# Altium schematic sheet schSPI.SchDoc
size A4
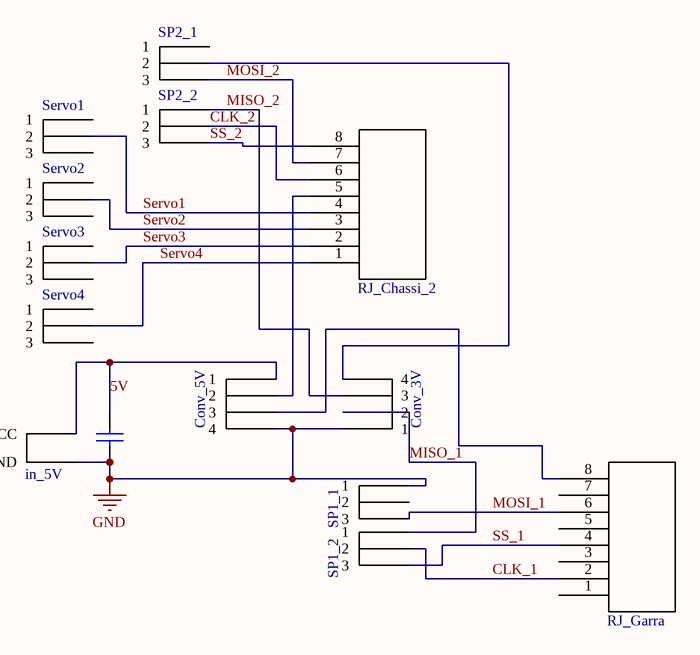
[diagram p0: schSPI.SchDoc]

## Parts
C2  Cap  [RAD-0.3]  (value not drawn)
Conv_3V  KK4  [4-vias]  (value not drawn)
Conv_5V  KK4  [4-vias]  (value not drawn)
in_5V  Jack  [JACK J4]  (value not drawn)
RJ_Chassi_2  RJ45  [RJ45_90]  (value not drawn)
RJ_Garra  RJ45  [RJ45_Simples]  (value not drawn)
Servo1  KK3  [3-vias]  (value not drawn)
Servo2  KK3  [3-vias]  (value not drawn)
Servo3  KK3  [3-vias]  (value not drawn)
Servo4  KK3  [3-vias]  (value not drawn)
SP1_1  KK3  [3-vias]  (value not drawn)
SP1_2  KK3  [3-vias]  (value not drawn)
SP2_1  KK3  [3-vias]  (value not drawn)
SP2_2  KK3  [3-vias]  (value not drawn)

## Nets
GND: C2.1 Conv_3V.1 Conv_5V.4 in_5V.2(GND) SP1_1.1
5V: C2.2 Conv_5V.1 in_5V.1(VCC)
CLK_1: RJ_Garra.2 SP1_2.2
CLK_2: RJ_Chassi_2.6 SP2_2.2
MISO_1: Conv_3V.2 SP1_2.1
MISO_2: Conv_3V.3 SP2_2.1
MOSI_1: RJ_Garra.6 SP1_1.3
MOSI_2: RJ_Chassi_2.7 SP2_1.3
Servo1: RJ_Chassi_2.4 Servo1.2
Servo2: RJ_Chassi_2.3 Servo2.2
Servo3: RJ_Chassi_2.2 Servo3.2
Servo4: RJ_Chassi_2.1 Servo4.2
SS_1: RJ_Garra.4 SP1_2.3
SS_2: RJ_Chassi_2.8 SP2_2.3
NetConv_3V_4: Conv_3V.4 SP2_1.2
NetConv_5V_2: Conv_5V.2 RJ_Chassi_2.5
NetConv_5V_3: Conv_5V.3 RJ_Garra.8

Not connected (* = marked no-connect by the designer): RJ_Garra 1(9) 3 5 7; Servo1 1 3; Servo2 1 3; Servo3 1 3; Servo4 1 3; SP1_1 2; SP2_1 1

## Library data of the parts
C2 = Cap: Capacitor; Value: 100pF; Published: 8-Jun-2000; LatestRevisionDate: 17-Jul-2002; LatestRevisionNote: Re-released for DXP Platform.; PackageReference: RAD-0.3; Publisher: Altium Limited; PackageDescription: Radial Cap, Thru-Hole; 2 Leads; 0.3 in Pin Spacing
Conv_3V Conv_5V = KK4Vias: ComponentLink1Description: Fabricante; ComponentLink1URL: https://www.molex.com/molex/products/family?key=kk_254_rpc_connector_system&channel=products&chanName=family&pageTitle=Introduction&parentKey=kk_interconnect_solutions
RJ_Chassi_2 = RJ45_90
Servo1-Servo4 SP1_1 SP1_2 SP2_1 SP2_2 = KK3Vias